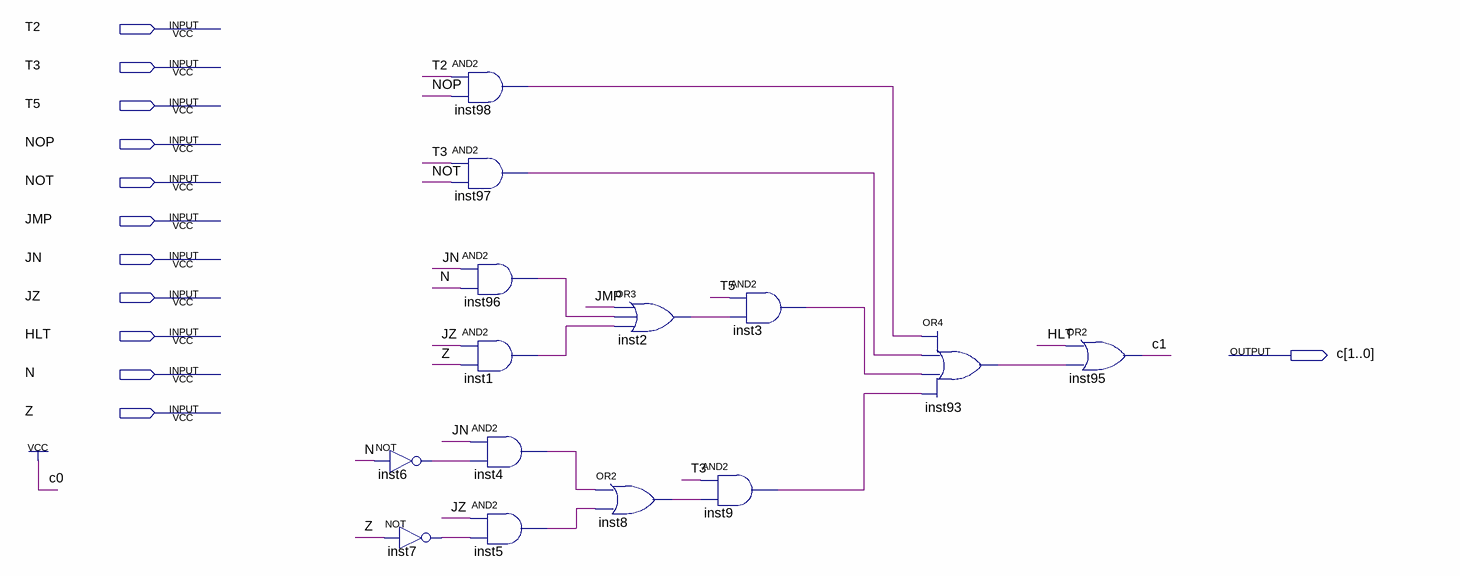
[diagram p0: schematic sheet]
// Quartus schematic abk_logica_temp.bdf as structural Verilog: 14 symbols, 12 pins
module abk_logica_temp (
  input  T2,
  input  T3,
  input  T5,
  input  NOP,
  input  NOT,
  input  JMP,
  input  JN,
  input  JZ,
  input  HLT,
  input  N,
  input  Z,
  output [1:0] c
);

  wire inst1_out, inst2_out, inst3_out, inst4_out, inst5_out, inst6_out, inst7_out, inst8_out, inst9_out,
       inst93_out, inst96_out, inst97_out, inst98_out;

  not inst6 (inst6_out, N);
  not inst7 (inst7_out, Z);
  and inst98 (inst98_out, T2, NOP);
  and inst97 (inst97_out, T3, NOT);
  and inst96 (inst96_out, JN, N);
  and inst1 (inst1_out, JZ, Z);
  and inst4 (inst4_out, JN, inst6_out);
  and inst5 (inst5_out, JZ, inst7_out);
  or inst2 (inst2_out, JMP, inst96_out, inst1_out);
  or inst8 (inst8_out, inst4_out, inst5_out);
  and inst3 (inst3_out, T5, inst2_out);
  and inst9 (inst9_out, T3, inst8_out);
  or inst93 (inst93_out, inst98_out, inst97_out, inst3_out, inst9_out);
  or inst95 (c[1], HLT, inst93_out);

  assign c[0] = 1'b1;
endmodule
